# EAGLE design LED_board_2 (EAGLE 7.4.0)
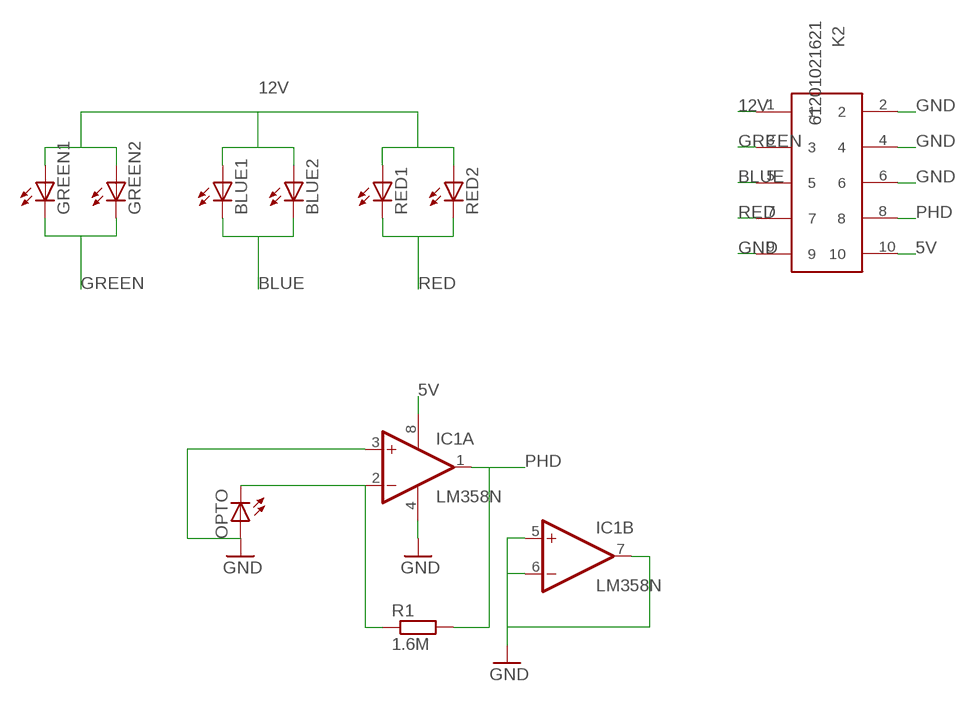
[diagram p0: schematic, sheet 1]

## Parts
BLUE1  LED5MM  [LED5MM]
BLUE2  LED5MM  [LED5MM]
GREEN1  LED5MM  [LED5MM]
GREEN2  LED5MM  [LED5MM]
IC1  LM358N  [DIL08]
K2  61201021621  [61201021621]
OPTO  LED5MM  [LED5MM]
R1  1.6M  R-EU_0207/10  [0207/10]
RED1  LED5MM  [LED5MM]
RED2  LED5MM  [LED5MM]

## Nets
5V: IC1.8(P:V+) K2.10
12V: BLUE1.A BLUE2.A GREEN1.A GREEN2.A K2.1 RED1.A RED2.A
BLUE: BLUE1.K(C) BLUE2.K(C) K2.5
GND: IC1.3(A:+IN) IC1.4(P:V-) IC1.5(B:+IN) IC1.6(B:-IN) IC1.7(B:OUT) K2.2 K2.4 K2.6 K2.9 OPTO.A
GREEN: GREEN1.K(C) GREEN2.K(C) K2.3
N$2: IC1.2(A:-IN) OPTO.K(C) R1.1
PHD: IC1.1(A:OUT) K2.8 R1.2
RED: K2.7 RED1.K(C) RED2.K(C)

## Library data of the parts
BLUE1 BLUE2 GREEN1 GREEN2 OPTO RED1 RED2 = led:LED: LED OSRAM: - CHIPLED LG R971, LG N971, LY N971, LG Q971, LY Q971, LO R971, LY R971 LH N974, LH R974 LS Q976, LO Q976, LY Q976 LO Q996 - Hyper CHIPLED LW Q18S LB Q993, LB Q99A, LB R99A - SideLED LS A670, LO A670, LY A670, LG A670, LP A670 LB A673, LV A673, LT A673, LW A673 LH A674 LY A675 LS A676, LA A676, LO A676, LY A676, LW A676 LS A679, LY A679, LG A679 - Hyper Micro SIDELED® LS Y876, LA Y876, LO Y876, LY Y876 LT Y87S - SmartLED LW L88C, LW L88S LB L89C, LB L89S, LG L890 LS L89K, LO L89K, LY L89K LS L896, LA L896, LO L896, LY L896 - TOPLED LS T670, LO T670, LY T670, LG T670, LP T670 LSG T670, LSP T670, LSY T670, LOP T670, LYG T670 LG T671, LOG T671, LSG T671 LB T673, LV T673, LT T673, LW T673 LH T674 LS T676, LA T676, LO T676, LY T676, LB T676, LH T676, LSB T676, LW T676 LB T67C, LV T67C, LT T67C, LS T67K, LO T67K, LY T67K, LW E67C LS E67B, LA E67B, LO E67B, LY E67B, LB E67C, LV E67C, LT E67C LW T67C LS T679, LY T679, LG T679 LS T770, LO T770, LY T770, LG T770, LP T770 LB T773, LV T773, LT T773, LW T773 LH T774 LS E675, LA E675, LY E675, LS T675 LS T776, LA T776, LO T776, LY T776, LB T776 LHGB T686 LT T68C, LB T68C - Hyper Mini TOPLED® LB M676 - Mini TOPLED Santana® LG M470 LS M47K, LO M47K, LY M47K Source: http://www.osram.convergy.de LUXEON: - LUMILED® LXK2-PW12-R00, LXK2-PW12-S00, LXK2-PW14-U00, LXK2-PW14-V00 LXK2-PM12-R00, LXK2-PM12-S00, LXK2-PM14-U00 LXK2-PE12-Q00, LXK2-PE12-R00, LXK2-PE12-S00, LXK2-PE14-T00, LXK2-PE14-U00 LXK2-PB12-K00, LXK2-PB12-L00, LXK2-PB12-M00, LXK2-PB14-N00, LXK2-PB14-P00, LXK2-PB14-Q00 LXK2-PR12-L00, LXK2-PR12-M00, LXK2-PR14-Q00, LXK2-PR14-R00 LXK2-PD12-Q00, LXK2-PD12-R00, LXK2-PD12-S00 LXK2-PH12-R00, LXK2-PH12-S00 LXK2-PL12-P00, LXK2-PL12-Q00, LXK2-PL12-R00 Source: www.luxeon.com KINGBRIGHT: KA-3528ASYC Source: www.kingbright.com
IC1 = linear:LM358: OP AMP also LM158; LM258; LM2904 Source: http://cache.national.com/ds/LM/LM158.pdf
K2 = Wurth_Elektronik_Electromechanic_Wire_to_Board_Connectors_rev15c:61201021621: WR-BHD 2.54mm Male Box Header, 10 Pins=>Code : Con_WTB_BHD_2.54_Male_THT_WS_61201021621 <http://katalog.we-online.de/media/thumbs2/eican/thb_Con_WTB_BHD_2.54_Male_THT_WS_6120xx21621_pf2.jpg> Details see: http://katalog.we-online.de/en/em/612_0xx_216_21 Created 2014-06-04, Karrer Zheng 2014 (C) Würth Elektronik
R1 = resistor:R-EU_: RESISTOR, European symbol

## Board
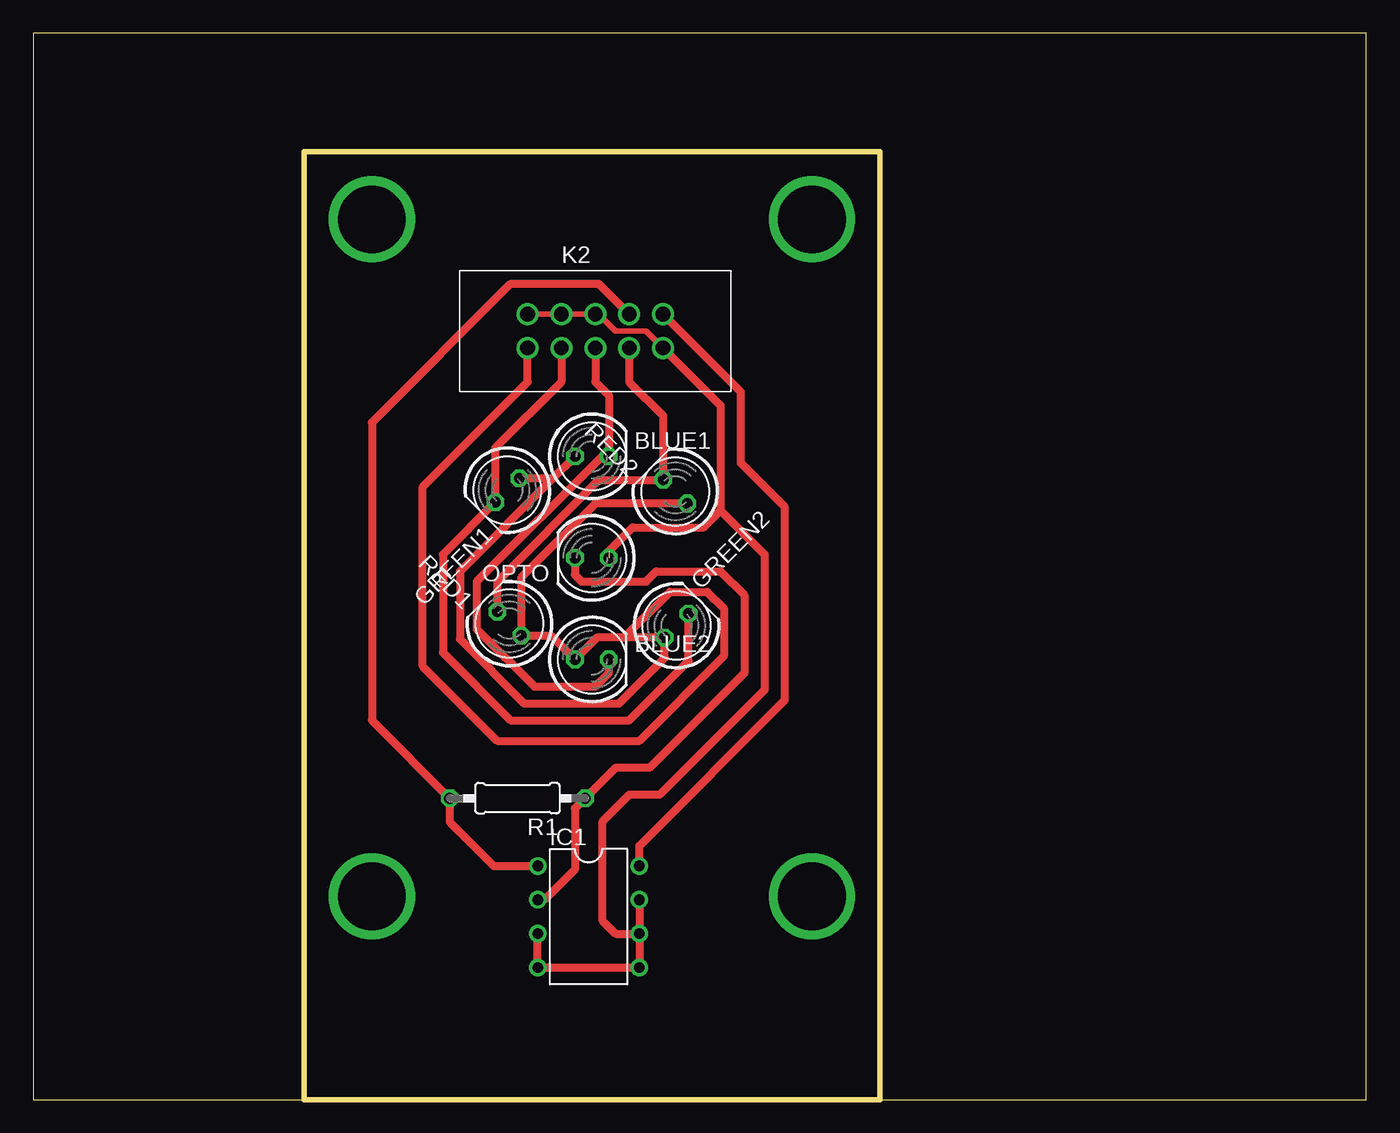
[diagram p1: board, top side]

Size 100 x 80 mm. Coordinates in mm from the lower left corner, seen from the top.
Outline: 20.32,0 0,0 0,80 100,80 100,0 63.5,0
Outline: 63.5,0 63.5,71.12 20.32,71.12 20.32,0
Outline: 20.32,0 63.5,0
Copper layers (1*16): Top 0.035mm / dielectric 1.5mm / Bottom 0.035mm
Design rules "default": minimum track width 10mil, minimum drill 24mil, track to track 8mil, track to pad 8mil, pad to pad 8mil, via to via 8mil, smd to smd 8mil, copper to edge 40mil, drill to drill 8mil, minimum pad ring 10mil, minimum via ring 8mil, stop-mask expansion 4mil, vias tented up to drill 0mil, thermal gap 10mil

### Footprints (pad centres in the part's own frame; a part is rotated, then mirrored left to right if it is on the bottom)
LED5MM = drill 0.813 octagon: A -1.27,0; K 1.27,0
DIL08 = drill 0.813 pad 1.27: 1 -3.81,-3.81; 2 -1.27,-3.81; 3 1.27,-3.81; 4 3.81,-3.81; 5 3.81,3.81; 6 1.27,3.81; 7 -1.27,3.81; 8 -3.81,3.81
61201021621 = drill 1.1: 1 -2.54,-1.27; 2 -2.54,1.27; 3 0,-1.27; 4 0,1.27; 5 2.54,-1.27; 6 2.54,1.27; 7 5.08,-1.27; 8 5.08,1.27; 9 7.62,-1.27; 10 7.62,1.27
0207/10 = drill 0.813 octagon: 1 -5.08,0; 2 5.08,0

### Placement (x,y rotation side)
BLUE1  41.91,48.26 0 top
BLUE2  41.91,33.02 0 top
GREEN1  35.56,45.72 225 top
GREEN2  48.26,35.56 45 top
IC1  41.66,13.72 270 top
K2  39.62,57.66 0 top
OPTO  41.91,40.64 180 top
R1  [0207/10]  36.32,22.61 180 top
RED1  35.71,35.71 135 top
RED2  48.16,45.62 135 top

### Tracks (layer width: path | path; a pad name or v marks a point on that pad's centre or on a via)
5V
  Top 0.61: IC1.8 45.47,19.05 56.39,29.97 56.39,44.45 53.09,47.75 53.09,53.09 K2.10
12V
  Top 0.61: 44.31,34.66 GREEN2.A 47.36,33.14 43.94,29.72 36.83,29.72 32,34.54 32,39.62 39,46.62 | 44.31,34.66 42.28,34.66 BLUE2.A 38.85,34.81 RED1.A 36.61,39.15 42.18,44.72 RED2.A | BLUE1.A 39,46.62 | GREEN1.A 39,46.62 | 44.31,34.66 47.75,38.1 50.55,38.1 51.82,36.83 51.82,33.27 45.47,26.92 34.8,26.92 29.21,32.51 29.21,45.97 37.08,53.85 K2.1
BLUE
  Top 0.61: K2.5 42.16,53.85 43.18,52.83 BLUE1.K 42.67,48.26 33.27,38.86 33.27,35.31 37.59,30.99 42.16,30.99 43.18,32 BLUE2.K
GND  (1 unrouted)
  Top 0.406: K2.2 K2.4 K2.6 42.42,58.93 43.69,57.66 45.97,57.66 K2.9
  Top 0.61: 43.18,41.15 44.96,42.93 50.29,42.93 51.56,44.2 | IC1.6 IC1.5 IC1.4 IC1.3 | K2.9 51.56,52.07 51.56,44.2 | 51.56,44.2 54.86,40.89 54.86,30.73 46.99,22.86 44.7,22.86 42.67,20.83 42.67,13.46 43.69,12.45 IC1.6 | IC1.7 IC1.6
GREEN
  Top 0.61: K2.3 39.62,53.85 34.66,48.89 GREEN1.K 30.73,40.89 30.73,33.53 35.81,28.45 44.7,28.45 49.16,32.9 GREEN2.K
N$2
  Top 0.61: OPTO.K 40.64,39.37 41.15,38.86 45.97,38.86 46.74,39.62 51.56,39.62 53.34,37.85 53.34,32 46.23,24.89 43.69,24.89 R1.1 40.64,21.84 40.64,17.27 38.35,14.99 IC1.2
N$6  (via drill 5.08 pad 6.45)
  other vias: 58.42,66.04
N$10  (via drill 5.08 pad 6.45)
  other vias: 25.4,15.24
N$14  (via drill 5.08 pad 6.45)
  other vias: 25.4,66.04
N$15  (via drill 5.08 pad 6.45)
  other vias: 58.42,15.24
PHD
  Top 0.61: K2.8 42.42,61.21 35.81,61.21 25.4,50.8 25.4,28.45 R1.2 31.24,20.83 34.54,17.53 IC1.1
RED
  Top 0.61: K2.7 44.7,53.85 47.24,51.31 47.24,46.53 RED2.K 47.23,46.48 42.42,46.48 34.81,38.88 RED1.K